# EAGLE schematic ble_shield (EAGLE 6.5.0)
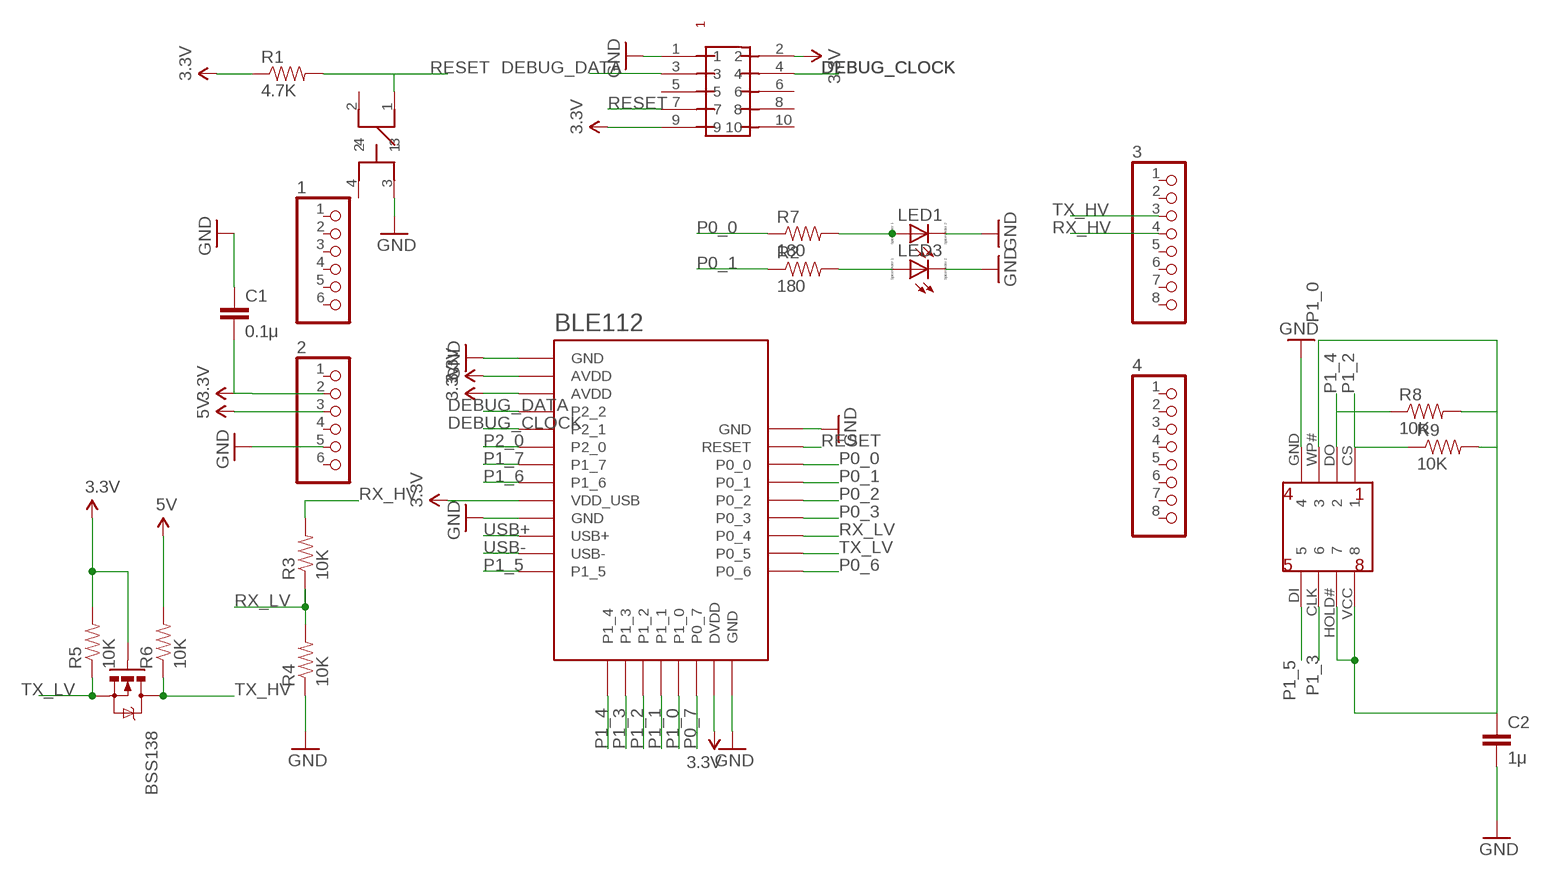
[diagram p0: schematic, sheet 1]

## Parts
1  PINHD-1X6CB  [1X06-CLEANBIG]
2  PINHD-1X6CB  [1X06-CLEANBIG]
3  PINHD-1X8CLEANBIG  [1X08-CLEANBIG]
4  PINHD-1X8CLEANBIG  [1X08-CLEANBIG]
BLE112  SF-BLUEGIGA_BLE112-A-VISUAL  [SF-BLUEGIGA_BLE112-A]
BSS138  MOSFET-NCHANNELSMD  [SOT23-3]
C1  0.1μ  CAP0603-CAP  [0603-CAP]
C2  1μ  CAP0603-CAP  [0603-CAP]
LED1  LED_ESML0603  [LED_SML0603]
LED3  LED_ESML0603  [LED_SML0603]
R1  4.7K  RESISTOR0603-RES  [0603-RES]
R2  180  RESISTOR0603-RES  [0603-RES]
R3  10K  RESISTOR0603-RES  [0603-RES]
R4  10K  RESISTOR0603-RES  [0603-RES]
R5  10K  RESISTOR0603-RES  [0603-RES]
R6  10K  RESISTOR0603-RES  [0603-RES]
R7  180  RESISTOR0603-RES  [0603-RES]
R8  10K  RESISTOR0603-RES  [0603-RES]
R9  10K  RESISTOR0603-RES  [0603-RES]
U$1  PIN-HEADER-SMT(1.27MM)2X5  [PIN-HEADER-SMT(1.27MM)2X5]
U$4  SWITCH-LS6J2M-T  [SWICTH-LS6J2M-T]
U$7  FLASH-MEMORY-2M(WINBOND)  [FLASH-MEMORY-2M(WINBOND)]

## Nets
3.3V: 2.2 BLE112.AVDD1(AVDD) BLE112.AVDD2(AVDD) BLE112.DVDD BLE112.VDD_USB BSS138.1(G) C1.2 R1.1 R5.2 U$1.2 U$1.9
5V: 2.3 R6.2
DEBUG_CLOCK: BLE112.P2_1 U$1.4
DEBUG_DATA: BLE112.P2_2 U$1.3
GND: 2.5 BLE112.GND1(GND) BLE112.GND2(GND) BLE112.GND3(GND) BLE112.GND4(GND) C1.1 C2.2 LED1.C LED3.C R4.1 U$1.1 U$4.3 U$7.GND
N$1: LED1.A R7.2
N$2: LED3.A R2.2
P0_0: BLE112.P0_0 R7.1
P0_1: BLE112.P0_1 R2.1
P0_2: BLE112.P0_2
P0_3: BLE112.P0_3
P0_6: BLE112.P0_6
P0_7: BLE112.P0_7
P1_0: BLE112.P1_0 C2.1 R8.2 R9.2 U$7.HOLD# U$7.VCC U$7.WP#
P1_1: BLE112.P1_1
P1_2: BLE112.P1_2 R9.1 U$7.CS
P1_3: BLE112.P1_3 U$7.CLK
P1_4: BLE112.P1_4 R8.1 U$7.DO
P1_5: BLE112.P1_5 U$7.DI
P1_6: BLE112.P1_6
P1_7: BLE112.P1_7
P2_0: BLE112.P2_0
RESET: BLE112.RESET R1.2 U$1.7 U$4.1
RX_HV: 3.4 R3.2
RX_LV: BLE112.P0_4 R3.1 R4.2
TX_HV: 3.3 BSS138.3(D) R6.1
TX_LV: BLE112.P0_5 BSS138.2(S) R5.1
USB+: BLE112.USB+
USB-: BLE112.USB-
Unconnected: 1.1 1.2 1.3 1.4 1.5 1.6 2.1 2.4 2.6 3.1 3.2 3.5 3.6 3.7 3.8 4.1 4.2 4.3 4.4 4.5 4.6 4.7 4.8 U$1.5 U$1.6 U$1.8 U$1.10 U$4.2 U$4.4

## Library data of the parts
1 2 = adafruit:PINHD-1X6: PIN HEADER
3 4 = adafruit:PINHD-1X8: PIN HEADER
BLE112 = ble112:SF-BLUEGIGA_BLE112-A-VISUAL: Bluetooth Low Energy single-mode module - Bluetooth 4.0, chip antenna
BSS138 = SparkFun:MOSFET-NCHANNEL
C1 C2 = SparkFun:CAP: Capacitor Standard 0603 ceramic capacitor, and 0.1" leaded capacitor.
LED1 LED3 = eagle-ltspice:LED_E: LED Source: http://www.osram.convergy.de Source: www.luxeon.com Source: www.kingbright.com; SPICEMODEL: NONE; SPICEPREFIX: D; SPICETYPE: diode
R1-R9 = SparkFun:RESISTOR: Resistor Basic schematic elements and footprints for 0603, 1206, and PTH resistors.
U$1 = gclue:PIN-HEADER-SMT(1.27MM)2X5: PIN-HEADER-SMT (1.27MM) 2x5
U$4 = gclue:SWITCH-LS6J2M-T
U$7 = gclue:FLASH-MEMORY-2M(WINBOND)